# Altium project aig21.PrjPcb
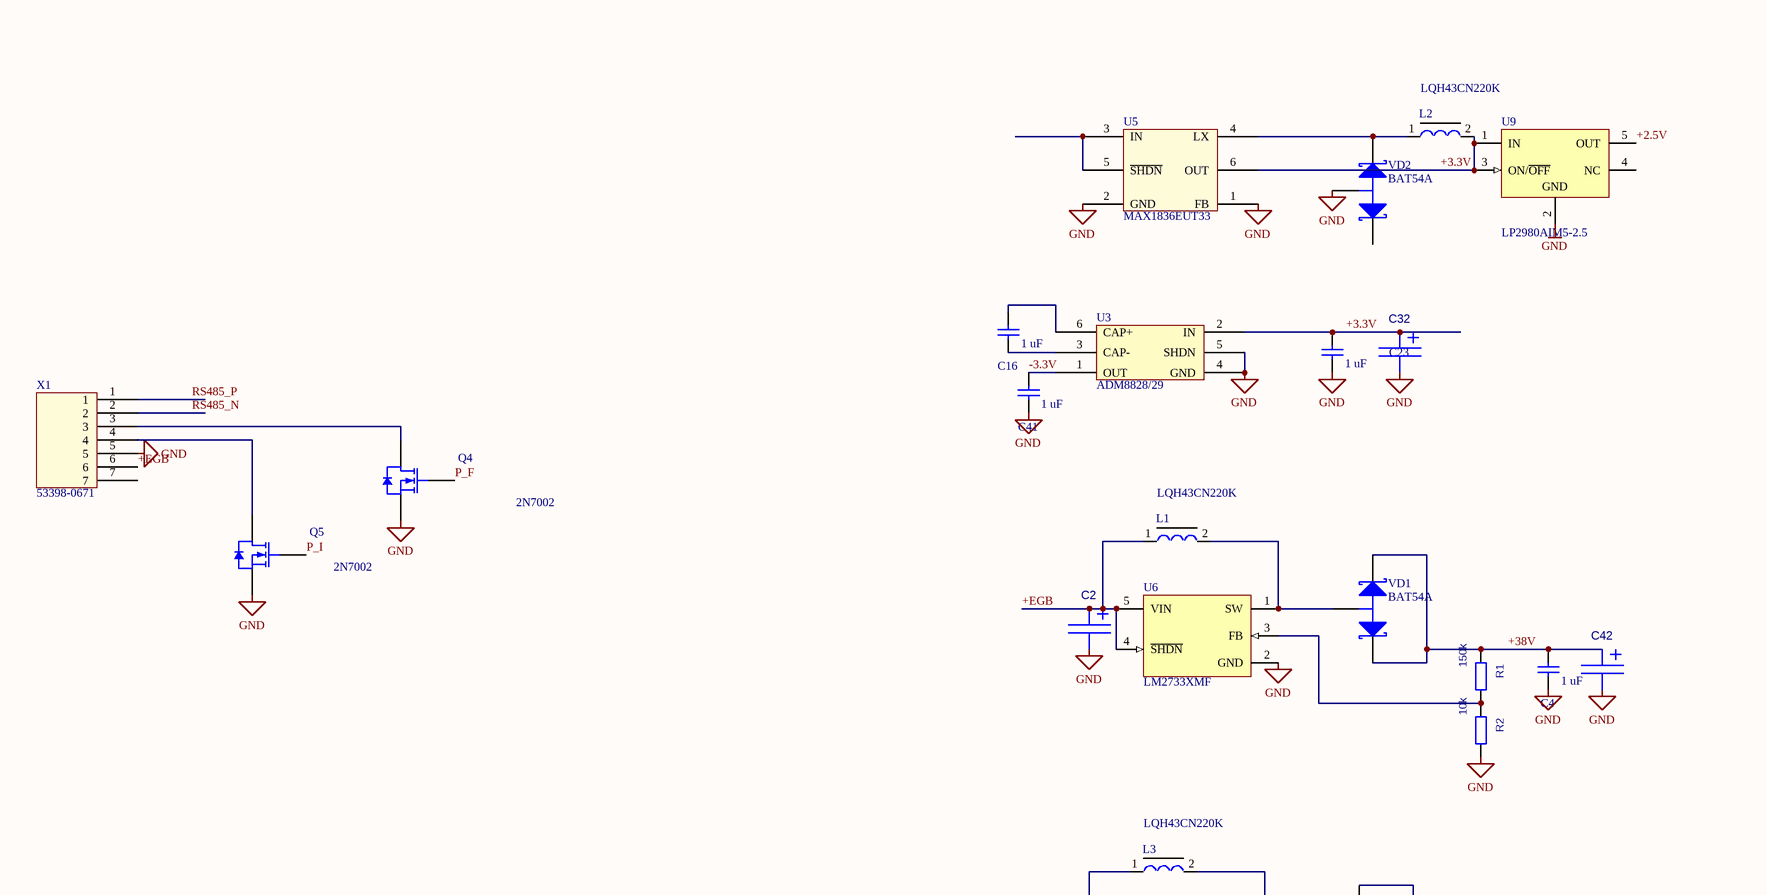
[diagram p0: aig21.SchDoc, top left]
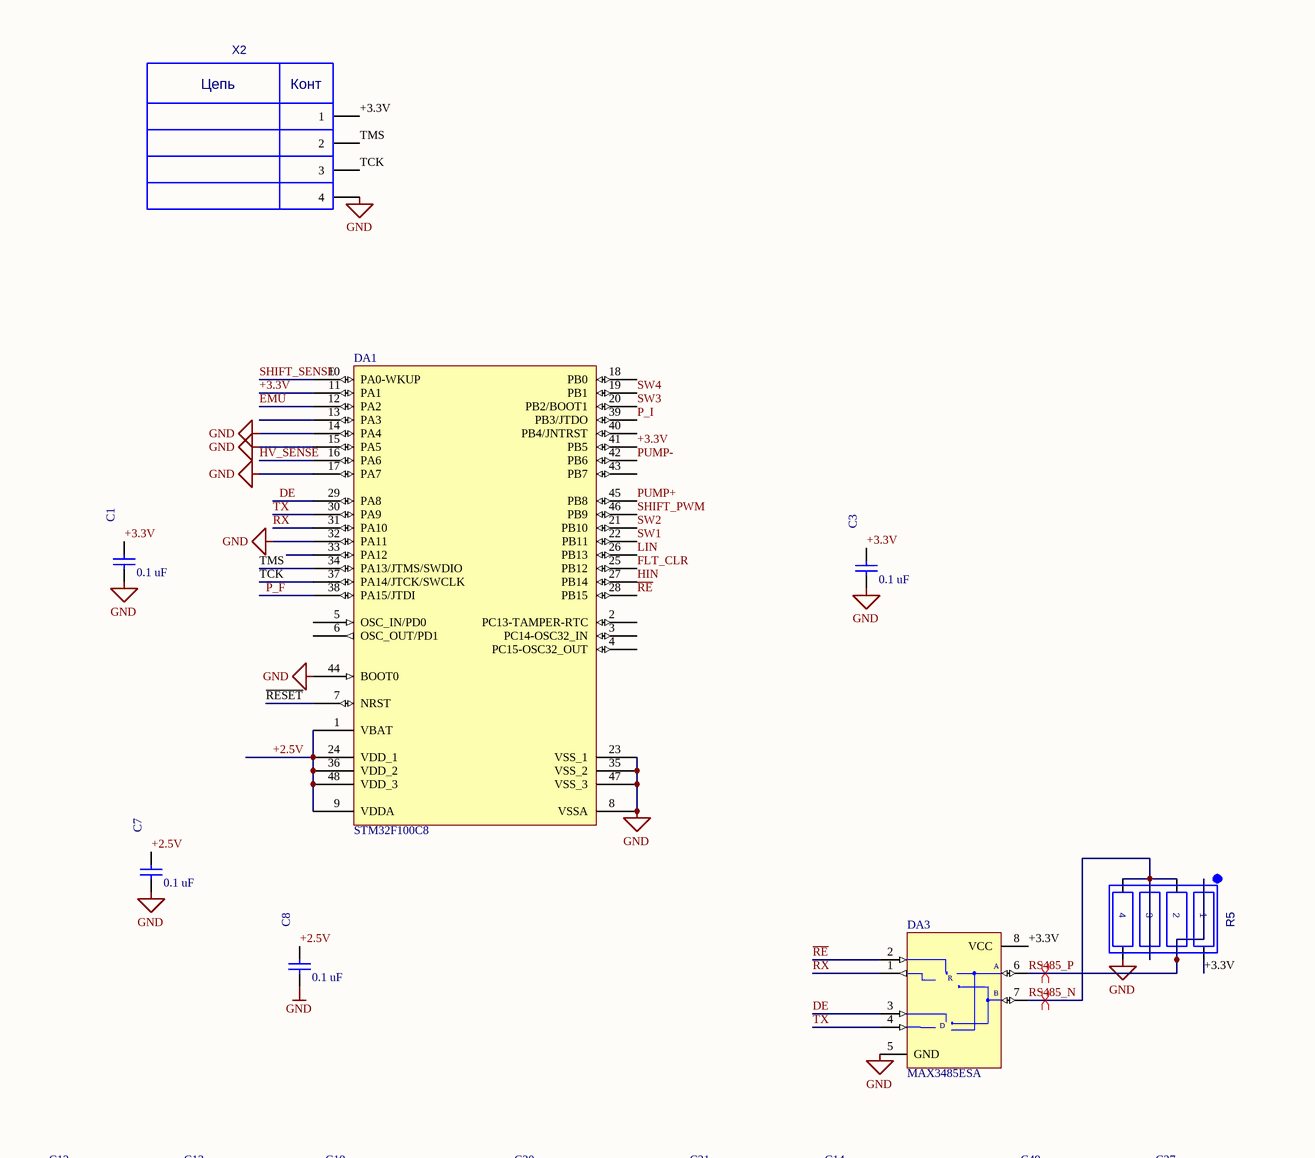
[diagram p1: aig21.SchDoc, top middle]
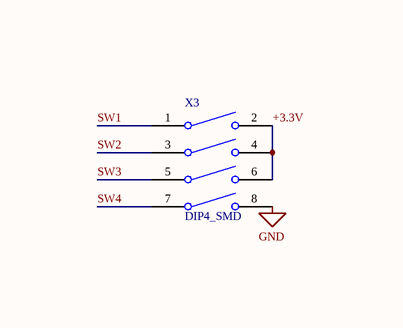
[diagram p2: aig21.SchDoc, top right]
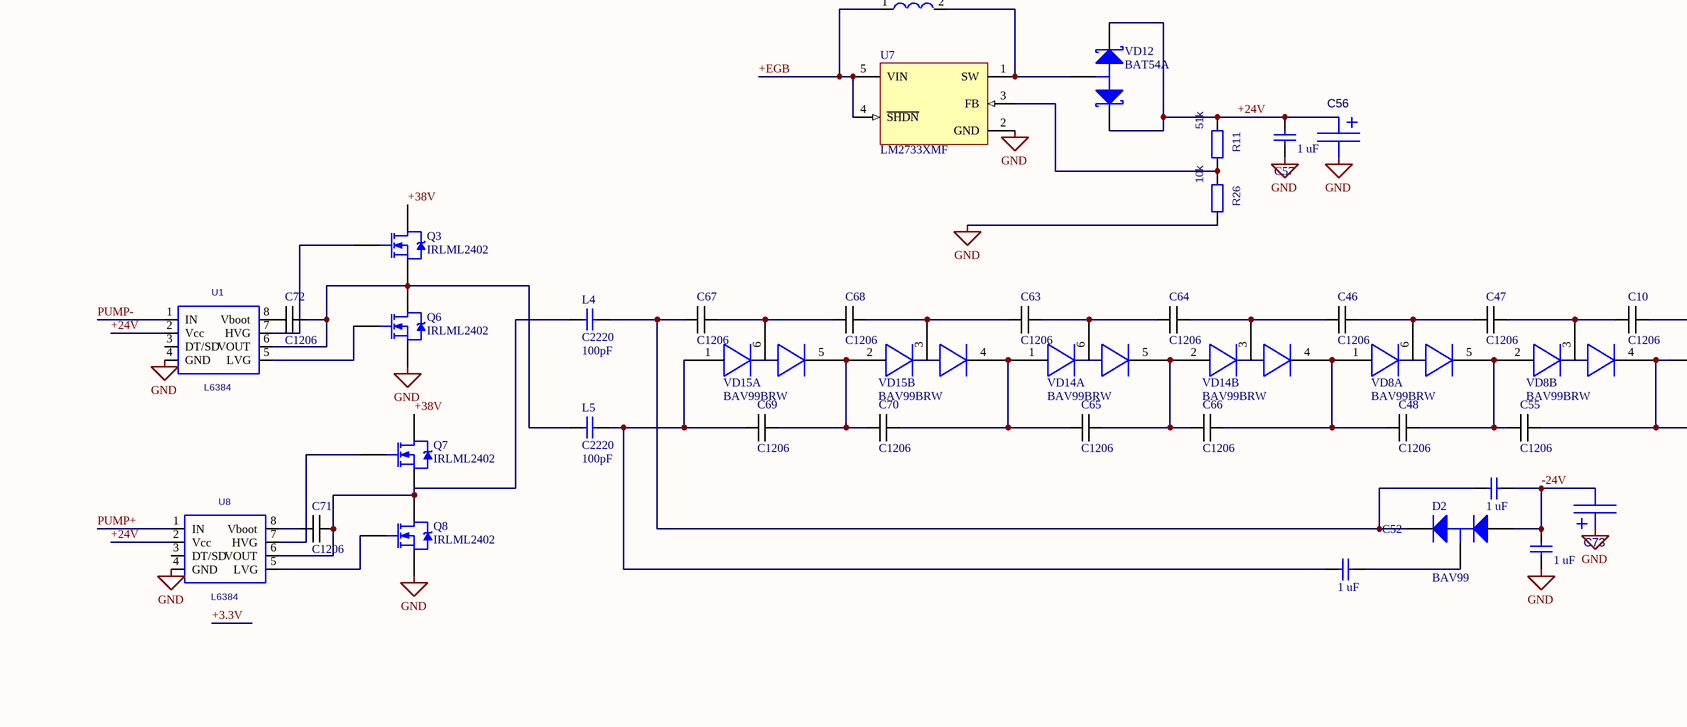
[diagram p3: aig21.SchDoc, bottom left]
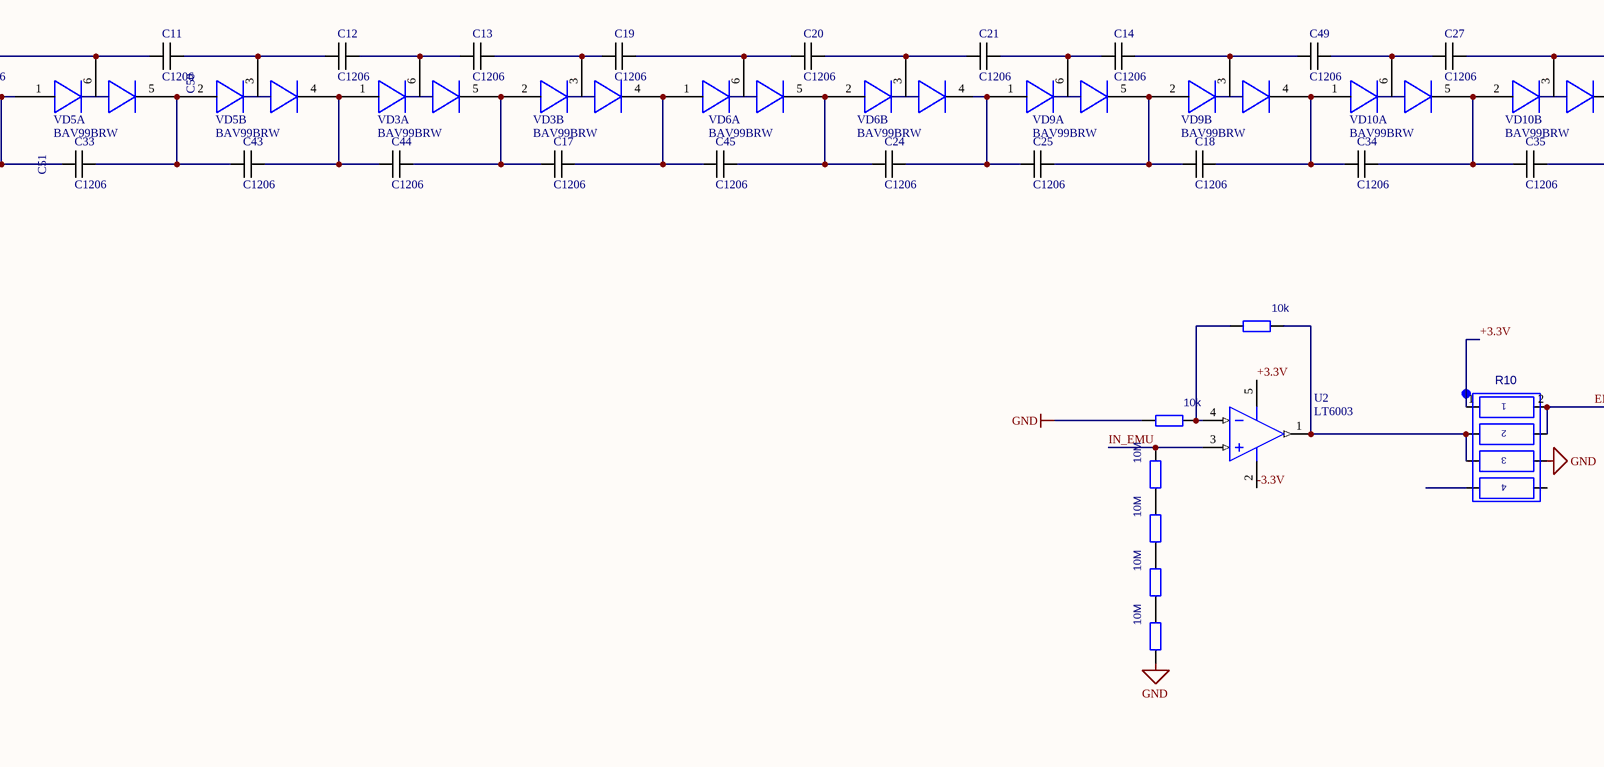
[diagram p4: aig21.SchDoc, bottom middle]
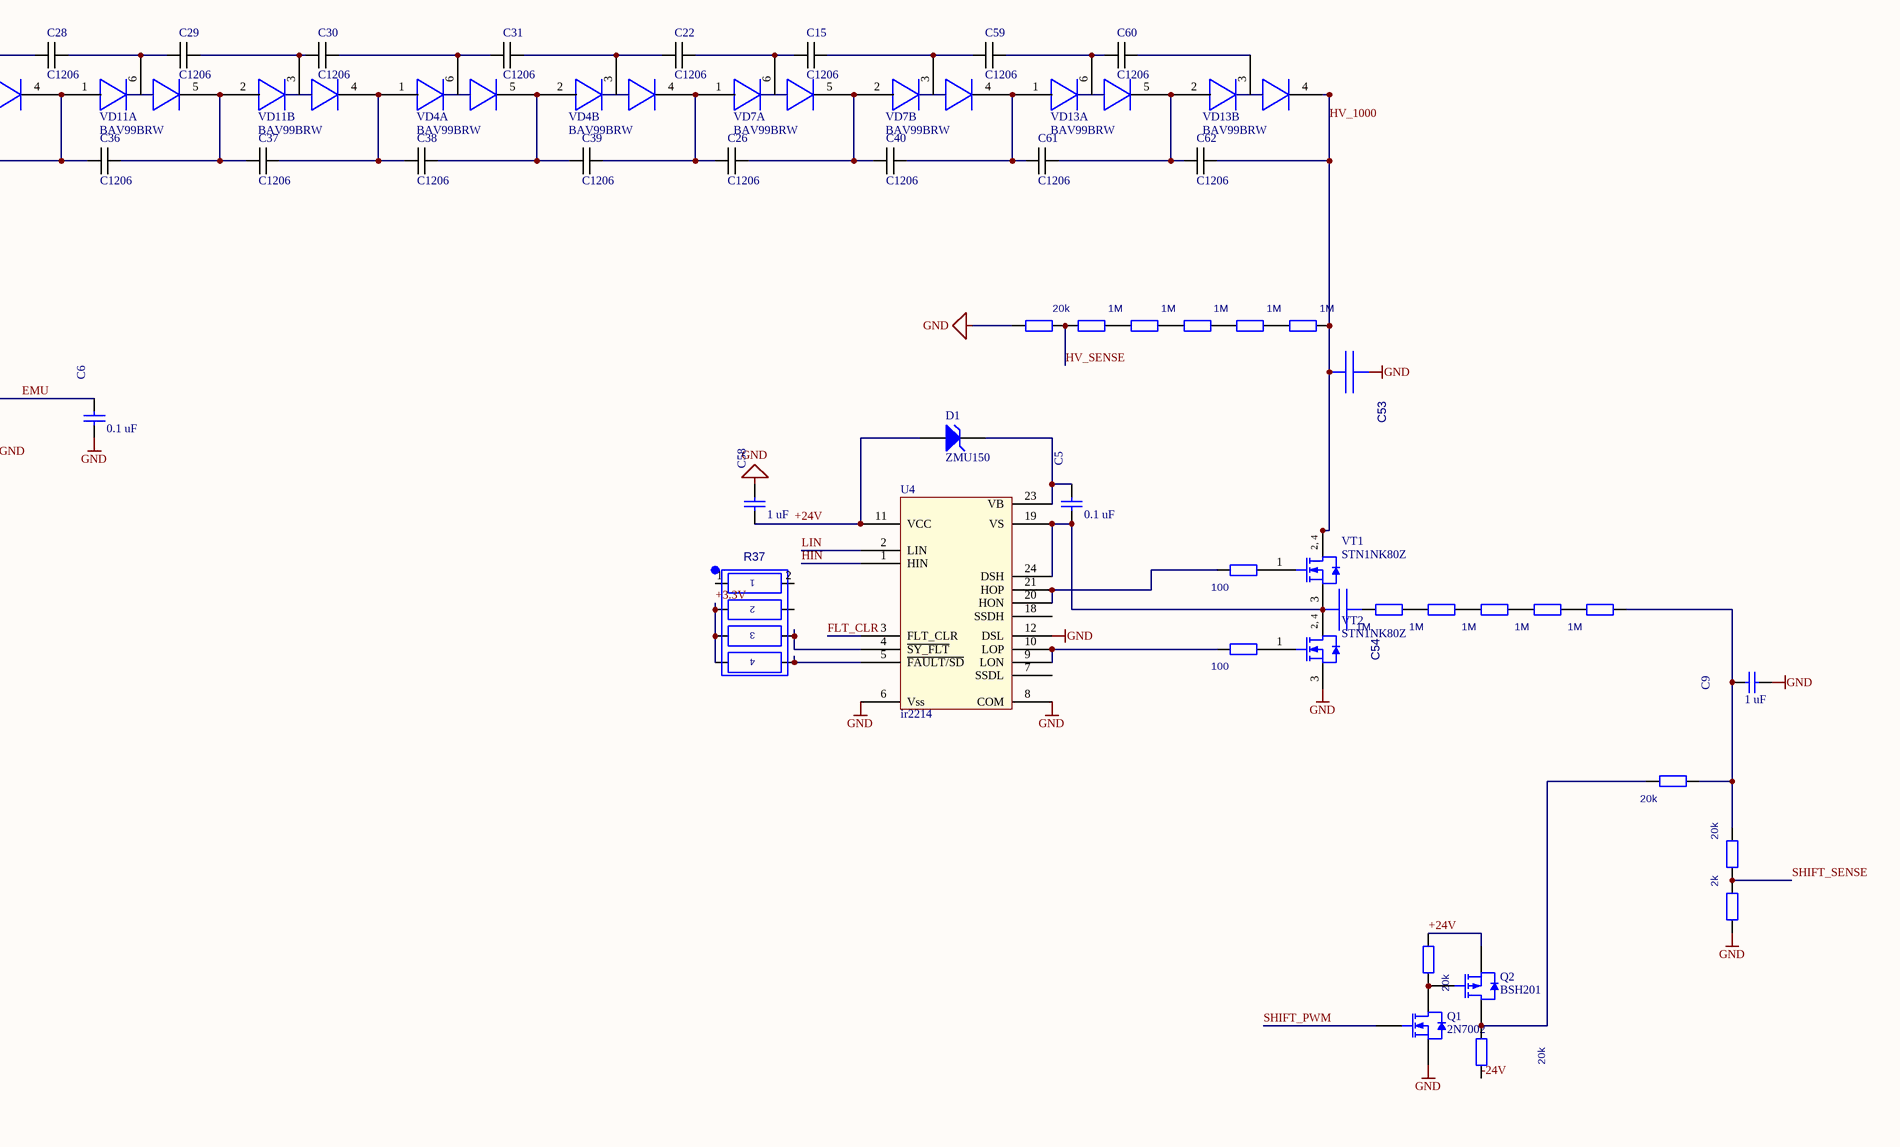
[diagram p5: aig21.SchDoc, bottom right]
1 sheet, 150 parts. Net scope: global (net labels, ports and power ports of the same name join across sheets).
Board file: aig21.PcbDoc

## Sheet aig21.SchDoc
size A0

### Parts
(Parts that share a designator on the sheet are numbered #1, #2 ... from top to bottom, then left to right.)
C1  value 0.1 uF  [CC0805]  (hidden comment: C0805)
C2  CAPASITOR A  [CAPASITOR A]  (value not drawn)
C3  value 0.1 uF  [CC0805]  (hidden comment: C0805)
C4  value 1 uF  [CC0805]  (hidden comment: C0805)
C5  value 0.1 uF  [CC0805]  (hidden comment: C0805)
C6  value 0.1 uF  [CC0805]  (hidden comment: C0805)
C7  value 0.1 uF  [CC0805]  (hidden comment: C0805)
C8  value 0.1 uF  [CC0805]  (hidden comment: C0805)
C9  value 1 uF  [CC0805]  (hidden comment: C0805)
C10  C1206  [С1206]
C11  C1206  [С1206]
C12  C1206  [С1206]
C13  C1206  [С1206]
C14  C1206  [С1206]
C15  C1206  [С1206]
C16  value 1 uF  [CC0805]  (hidden comment: C0805)
C17  C1206  [С1206]
C18  C1206  [С1206]
C19  C1206  [С1206]
C20  C1206  [С1206]
C21  C1206  [С1206]
C22  C1206  [С1206]
C23  value 1 uF  [CC0805]  (hidden comment: C0805)
C24  C1206  [С1206]
C25  C1206  [С1206]
C26  C1206  [С1206]
C27  C1206  [С1206]
C28  C1206  [С1206]
C29  C1206  [С1206]
C30  C1206  [С1206]
C31  C1206  [С1206]
C32  CAPASITOR A  [CAPASITOR A]  (value not drawn)
C33  C1206  [С1206]
C34  C1206  [С1206]
C35  C1206  [С1206]
C36  C1206  [С1206]
C37  C1206  [С1206]
C38  C1206  [С1206]
C39  C1206  [С1206]
C40  C1206  [С1206]
C41  value 1 uF  [CC0805]  (hidden comment: C0805)
C42  CAPASITOR C  [CAPASITOR C]  (value not drawn)
C43  C1206  [С1206]
C44  C1206  [С1206]
C45  C1206  [С1206]
C46  C1206  [С1206]
C47  C1206  [С1206]
C48  C1206  [С1206]
C49  C1206  [С1206]
C50  value 1 uF  [CC0805]  (hidden comment: C0805)
C51  value 1 uF  [CC0805]  (hidden comment: C0805)
C52  value 1 uF  [CC0805]  (hidden comment: C0805)
C53  CC1812  [CC1812]  (value not drawn)
C54  CC1812  [CC1812]  (value not drawn)
C55  C1206  [С1206]
C56  CAPASITOR C  [CAPASITOR C]  (value not drawn)
C57  value 1 uF  [CC0805]  (hidden comment: C0805)
C58  value 1 uF  [CC0805]  (hidden comment: C0805)
C59  C1206  [С1206]
C60  C1206  [С1206]
C61  C1206  [С1206]
C62  C1206  [С1206]
C63  C1206  [С1206]
C64  C1206  [С1206]
C65  C1206  [С1206]
C66  C1206  [С1206]
C67  C1206  [С1206]
C68  C1206  [С1206]
C69  C1206  [С1206]
C70  C1206  [С1206]
C71  C1206  [С1206]
C72  C1206  [С1206]
C73  CAPASITOR C  [CAPASITOR C]  (value not drawn)
D1  ZMU150  [MELF]
D2  BAV99  [SOT-23]
DA1  STM32F100C8  [LQFP48_N]
DA3  MAX3485ESA  [NSO8_N]
L1  LQH43CN220K  [1812]
L2  LQH43CN220K  [1812]
L3  LQH43CN220K  [1812]
L4  C2220  value 100pF  [2220]
L5  C2220  value 100pF  [2220]
Q1  2N7002  [SOT-23]
Q2  BSH201  [SOT23]
Q3  IRLML2402  [SOT-23]
Q4  2N7002  [SOT23_N]
Q5  2N7002  [SOT23_N]
Q6  IRLML2402  [SOT-23]
Q7  IRLML2402  [SOT-23]
Q8  IRLML2402  [SOT-23]
R1  value 150k  [RR0805]
R2  value 10k  [RR0805]
R3  value 10M  [RR0805]
R4  value 10k  [RR0805]
R5  CAY16-J4  [CAY16-F4]  (value not drawn)
R6  value 10M  [RR0805]
R7  value 10M  [RR0805]
R8  value 20k  [RR0805]
R9  value 10k  [RR0805]
R10  CAY16-J4  [CAY16-F4]  (value not drawn)
R11  value 51k  [RR0805]
R12  value 1M  [RR0805]
R13  value 1M  [RR0805]
R14  value 1M  [RR0805]
R15  value 1M  [RR0805]
R16  value 1M  [RR0805]
R17  value 100  [RR0805]
R18  value 100  [RR0805]
R19  value 20k  [RR0805]
R20  value 20k  [RR0805]
R21  value 1M  [RR0805]
R22  value 1M  [RR0805]
R23  value 1M  [RR0805]
R24  value 1M  [RR0805]
R25  value 1M  [RR0805]
R26  value 10k  [RR0805]
R28  value 10M  [RR0805]
R30  value 20k  [RR0805]
R31#1  value 20k  [RR0805]
R31#2  value 2k  [RR0805]
R37  CAY16-J4  [CAY16-F4]  (value not drawn)
U1  L6384  [SO8]
U2  LT6003  [SOT23-5_N]
U3  ADM8828/29  [SOT23-6]
U4  ir2214  [ssop24]
U5  MAX1836EUT33  [SOT23-6]
U6  LM2733XMF  [MF05A_N]
U7  LM2733XMF  [MF05A_N]
U8  L6384  [SO8]
U9  LP2980AIM5-2.5  [MF05A_N]
VD1  BAT54A  [SOT23_N]
VD2  BAT54A  [SOT-23]
VD3  BAV99BRW  [SOT-363]  (parts A,B of 2)
VD4  BAV99BRW  [SOT-363]  (parts A,B of 2)
VD5  BAV99BRW  [SOT-363]  (parts A,B of 2)
VD6  BAV99BRW  [SOT-363]  (parts A,B of 2)
VD7  BAV99BRW  [SOT-363]  (parts A,B of 2)
VD8  BAV99BRW  [SOT-363]  (parts A,B of 2)
VD9  BAV99BRW  [SOT-363]  (parts A,B of 2)
VD10  BAV99BRW  [SOT-363]  (parts A,B of 2)
VD11  BAV99BRW  [SOT-363]  (parts A,B of 2)
VD12  BAT54A  [SOT23_N]
VD13  BAV99BRW  [SOT-363]  (parts A,B of 2)
VD14  BAV99BRW  [SOT-363]  (parts A,B of 2)
VD15  BAV99BRW  [SOT-363]  (parts A,B of 2)
VT1  STN1NK80Z  [SOT223_N]
VT2  STN1NK80Z  [SOT223_N]
X1  53398-0671  [53398-0671]
X2  53398-0471  [53398-0471]  (value not drawn)
X3  DIP4_SMD  [DIP4_SOP]

### Nets
GND: C1.1 C2.2(i/o1) C3.1 C4.2 C6.1 C7.1 C8.1 C9.1 C23.2 C32.2(i/o1) C41.2 C42.2(i/o1) C52.1 C53.1(i/o) C56.2(i/o1) C57.2 C58.2 C73.1(i/o) DA1.8(VSSA) DA1.14(PA4) DA1.15(PA5) DA1.17(PA7) DA1.23(VSS_1) DA1.32(PA11) DA1.35(VSS_2) DA1.44(BOOT0) DA1.47(VSS_3) DA3.5(GND) Q1.2(S) Q4.2(S) Q5.2(S) Q6.2(S) Q8.2(S) R2.2 R4.2 R5.8(I/O1) R8.2 R10.6(I/O1) R26.2 R28.2 R31#2.2 U1.4(GND) U3.4(GND) U3.5(SHDN) U4.6(Vss) U4.8(COM) U4.12(DSL) U5.1(FB) U5.2(GND) U6.2(GND) U7.2(GND) U8.4(GND) U9.2(GND) VD2.3(A) VT2.3(S) X1.5 X2.4 X3.8
+2.5V: C7.2 C8.2 DA1.1(VBAT) DA1.9(VDDA) DA1.24(VDD_1) DA1.36(VDD_2) DA1.48(VDD_3) U9.5(OUT)
+3.3V: C1.2 C3.2 C23.1 C32.1(i/o) DA1.11(PA1) DA1.41(PB5) DA3.8(VCC) L2.2 R5.2(I/O1) R10.1(I/O0) R37.3(I/O0) R37.5(I/O0) R37.7(I/O0) U2.5(VCC) U3.2(IN) U5.6(OUT) U9.1(IN) U9.3(ON/~{OFF}) X2.1 X3.2 X3.4 X3.6
+24V: C56.1(i/o) C57.1 C58.1 D1.1(A) Q2.2(S) R11.1 R20.2 U1.2(Vcc) U4.11(VCC) U8.2(Vcc) VD12.1(K1) VD12.2(K2)
+38V: C4.1 C42.1(i/o) Q3.3(D) Q7.3(D) R1.1 VD1.1(K1) VD1.2(K2)
+EGB: C2.1(i/o) L1.1 L3.1 U6.4(~{SHDN}) U6.5(VIN) U7.4(~{SHDN}) U7.5(VIN) X1.6
-3.3V: C41.1 U2.2(VEE) U3.1(OUT)
-24V: C50.2 C52.2 C73.2(i/o1) D2.1(A) R19.1
DE: DA1.29(PA8) DA3.3(DE)
EMU: C6.2 DA1.12(PA2) R10.2(I/O1) R10.4(I/O1)
FLT_CLR: DA1.25(PB12) U4.3(FLT_CLR)
HIN: DA1.27(PB14) U4.1(HIN)
HV_1000: C53.2(i/o1) C62.1 R16.1 VD13.4(K2) VT1.2(D) VT1.4(D)
HV_SENSE: DA1.16(PA6) R8.1 R12.2
IN_EMU: R3.1 U2.3(IN+)
LIN: DA1.26(PB13) U4.2(LIN)
P_F: DA1.38(PA15/JTDI) Q4.1(G)
P_I: DA1.39(PB3/JTDO) Q5.1(G)
PUMP+: DA1.45(PB8) U8.1(IN)
PUMP-: DA1.42(PB6) U1.1(IN)
~{RE}: DA1.28(PB15) DA3.2(~{RE})
~{RESET}: DA1.7(NRST)
RS485_N: DA3.7(B) R5.3(I/O0) R5.5(I/O0) R5.6(I/O1) R5.7(I/O0) X1.2
RS485_P: DA3.6(A) R5.1(I/O0) R5.4(I/O1) X1.1
RX: DA1.31(PA10) DA3.1(RO)
SHIFT_PWM: DA1.46(PB9) Q1.1(G)
SHIFT_SENSE: DA1.10(PA0-WKUP) R30.2 R31#2.1
SW1: DA1.22(PB11) X3.1
SW2: DA1.21(PB10) X3.3
SW3: DA1.20(PB2/BOOT1) X3.5
SW4: DA1.19(PB1) X3.7
TCK: DA1.37(PA14/JTCK/SWCLK) X2.3
TMS: DA1.34(PA13/JTMS/SWDIO) X2.2
TX: DA1.30(PA9) DA3.4(DI)
NetC5_1: C5.1 C54.2(i/o1) U4.19(VS) U4.24(DSH) VT1.3(S) VT2.2(D) VT2.4(D)
NetC5_2: C5.2 D1.2(K) U4.23(VB)
NetC9_2: C9.2 R25.2 R30.1 R31#1.2
NetC10_1: C10.1 C11.2 VD5.6(C1)
NetC10_2: C10.2 C47.1 VD8.3(C2)
NetC11_1: C11.1 C12.2 VD5.3(C2)
NetC12_1: C12.1 C13.2 VD3.6(C1)
NetC13_1: C13.1 C19.2 VD3.3(C2)
NetC14_1: C14.1 C49.2 VD9.3(C2)
NetC14_2: C14.2 C21.1 VD9.6(C1)
NetC15_1: C15.1 C59.2 VD7.3(C2)
NetC15_2: C15.2 C22.1 VD7.6(C1)
NetC16_1: C16.1 U3.6(CAP+)
NetC16_2: C16.2 U3.3(CAP-)
NetC17_1: C17.1 C45.2 VD3.4(K2) VD6.1(A1)
NetC17_2: C17.2 C44.1 VD3.2(A2) VD3.5(K1)
NetC18_1: C18.1 C34.2 VD9.4(K2) VD10.1(A1)
NetC18_2: C18.2 C25.1 VD9.2(A2) VD9.5(K1)
NetC19_1: C19.1 C20.2 VD6.6(C1)
NetC20_1: C20.1 C21.2 VD6.3(C2)
NetC22_2: C22.2 C31.1 VD4.3(C2)
NetC24_1: C24.1 C25.2 VD6.4(K2) VD9.1(A1)
NetC24_2: C24.2 C45.1 VD6.2(A2) VD6.5(K1)
NetC26_1: C26.1 C40.2 VD7.2(A2) VD7.5(K1)
NetC26_2: C26.2 C39.1 VD4.4(K2) VD7.1(A1)
NetC27_1: C27.1 C28.2 VD10.3(C2)
NetC27_2: C27.2 C49.1 VD10.6(C1)
NetC28_1: C28.1 C29.2 VD11.6(C1)
NetC29_1: C29.1 C30.2 VD11.3(C2)
NetC30_1: C30.1 C31.2 VD4.6(C1)
NetC33_1: C33.1 C43.2 VD5.2(A2) VD5.5(K1)
NetC33_2: C33.2 C55.1 VD5.1(A1) VD8.4(K2)
NetC34_1: C34.1 C35.2 VD10.2(A2) VD10.5(K1)
NetC35_1: C35.1 C36.2 VD10.4(K2) VD11.1(A1)
NetC36_1: C36.1 C37.2 VD11.2(A2) VD11.5(K1)
NetC37_1: C37.1 C38.2 VD4.1(A1) VD11.4(K2)
NetC38_1: C38.1 C39.2 VD4.2(A2) VD4.5(K1)
NetC40_1: C40.1 C61.2 VD7.4(K2) VD13.1(A1)
NetC43_1: C43.1 C44.2 VD3.1(A1) VD5.4(K2)
NetC46_1: C46.1 C47.2 VD8.6(C1)
NetC46_2: C46.2 C64.1 VD14.3(C2)
NetC48_1: C48.1 C55.2 VD8.2(A2) VD8.5(K1)
NetC48_2: C48.2 C66.1 VD8.1(A1) VD14.4(K2)
NetC50_1: C50.1 C67.2 D2.2(K) L4.2
NetC51_1: C51.1 C69.2 L5.2 VD15.1(A1)
NetC51_2: C51.2 D2.3(C)
NetC54_1: C54.1(i/o) R21.1
NetC59_1: C59.1 C60.2 VD13.6(C1)
NetC60_1: C60.1 VD13.3(C2)
NetC61_1: C61.1 C62.2 VD13.2(A2) VD13.5(K1)
NetC63_1: C63.1 C64.2 VD14.6(C1)
NetC63_2: C63.2 C68.1 VD15.3(C2)
NetC65_1: C65.1 C66.2 VD14.2(A2) VD14.5(K1)
NetC65_2: C65.2 C70.1 VD14.1(A1) VD15.4(K2)
NetC67_1: C67.1 C68.2 VD15.6(C1)
NetC69_1: C69.1 C70.2 VD15.2(A2) VD15.5(K1)
NetC71_1: C71.1 U8.8(Vboot)
NetC71_2: C71.2 L4.1 Q7.2(S) Q8.3(D) U8.6(VOUT)
NetC72_1: C72.1 L5.1 Q3.2(S) Q6.3(D) U1.6(VOUT)
NetC72_2: C72.2 U1.8(Vboot)
NetL1_2: L1.2 U6.1(SW) VD1.3(A)
NetL2_1: L2.1 U5.4(LX) VD2.2(K2)
NetL3_2: L3.2 U7.1(SW) VD12.3(A)
NetQ1_3: Q1.3(D) Q2.1(G) R20.1
NetQ2_3: Q2.3(D) R19.2 R31#1.1
NetQ3_1: Q3.1(G) U1.7(HVG)
NetQ4_3: Q4.3(D) X1.3
NetQ5_3: Q5.3(D) X1.4
NetQ6_1: Q6.1(G) U1.5(LVG)
NetQ7_1: Q7.1(G) U8.7(HVG)
NetQ8_1: Q8.1(G) U8.5(LVG)
NetR1_2: R1.2 R2.1 U6.3(FB)
NetR3_2: R3.2 R6.1
NetR4_1: R4.1 R9.2 U2.4(IN-)
NetR6_2: R6.2 R7.1
NetR7_2: R7.2 R28.1
NetR9_1: R9.1 R10.3(I/O0) R10.5(I/O0) U2.1(OUT)
NetR11_2: R11.2 R26.1 U7.3(FB)
NetR12_1: R12.1 R13.2
NetR13_1: R13.1 R14.2
NetR14_1: R14.1 R15.2
NetR15_1: R15.1 R16.2
NetR17_1: R17.1 U4.20(HON) U4.21(HOP)
NetR17_2: R17.2 VT1.1(G)
NetR18_1: R18.1 U4.9(LON) U4.10(LOP)
NetR18_2: R18.2 VT2.1(G)
NetR21_2: R21.2 R22.1
NetR22_2: R22.2 R23.1
NetR23_2: R23.2 R24.1
NetR24_2: R24.2 R25.1
NetR37_6: R37.6(I/O1) U4.4(~{SY_FLT})
NetR37_8: R37.8(I/O1) U4.5(~{FAULT/SD})
NetU5_3: U5.3(IN) U5.5(~{SHDN})

Not connected (* = marked no-connect by the designer): DA1 2(PC13-TAMPER-RTC) 3(PC14-OSC32_IN) 4(PC15-OSC32_OUT) 5(OSC_IN/PD0) 6(OSC_OUT/PD1) 13(PA3) 18(PB0) 33(PA12) 40(PB4/JNTRST) 43(PB7); R10 7(I/O0) 8(I/O1); R37 1(I/O0) 2(I/O1) 4(I/O1); U1 3(DT/SD); U4 7(SSDL) 18(SSDH); U8 3(DT/SD); U9 4(NC); VD2 1(K1); X1 7; X2 5(mh1) 6(mh2)

### Layout directives
differential pair: RS485_N, RS485_P

### Notes on the sheet
- (in symbol 53398-0471) Цепь; Конт
- (in symbol BSP130) 2, 4
- (in symbol MAX485ESA) R; D

### Library data of the parts
C1 C3-C9 C16 C23 C41 C50-C52 C57 C58 = C0805: Ceramic Chip Capacitor - Standard; Note: Footprint corresponds to dimensions for bulk cassette packaging. This case size has tightened tolerances.; Published: 17-Jul-2002; LatestRevisionDate: 19-Mar-2004; LatestRevisionNote: Silkscreen size reduced.; DatasheetDocument: Mar-2001; PackageDocument: Mar-2001; PackageReference: 0805; Publisher: Altium Limited; Code_JEITA: 0805; Code_IPC: 2012[0805]; ComponentLink1Description: Manufacturer Link; ComponentLink1URL: http://www.kemet.com/; ComponentLink2Description: Datasheet; ComponentLink2URL: http://www.kemet.com/kemet/web/homepage/kechome.nsf/vapubfilesname/F3102TA.pdf/$file/F3102TA.pdf
C10-C15 C17-C22 C24-C31 C33-C40 C43-C49 C55 C59-C72 = С1206: Конденсатор
C32 = CAPASITOR A: Value: 68uF X 6.3V
C42 = CAPASITOR C: Value: 50V
C53 C54 = CC1812: Value: 2200 x 3kV
C56 C73 = CAPASITOR C: Value: 25V
D1 = ZMU150: High-Voltage Power Zener Diode; Published: 8-Jun-2000; LatestRevisionDate: 19-Mar-2004; LatestRevisionNote: Silkscreen size reduced.; DatasheetDocument: 16-May-1997; PackageDocument: May-1997; PackageReference: MELF; Publisher: Altium Limited; ComponentLink1Description: Manufacturer Link; ComponentLink1URL: http://www.vishay.com/
D2 = BAV99: Silicon Switching Diode Array for High-Speed Switching; Published: 21-Mar-2003; DatasheetDocument: Oct-1999; PackageDocument: Sep-2001; PackageReference: SOT-23; Publisher: Altium Limited; ComponentLink1Description: Manufacturer Link; ComponentLink1URL: http://www.infineon.com/; ComponentLink2Description: Datasheet; ComponentLink2URL: http://www.infineon.com/upload/Document/cmc_upload/documents/080/631/bav99series_1.pdf
DA1 = STM32F101C6T6: STM32 ARM-based 32-bit MCU with 32 Kbytes Flash, 48-pin LQFP, Industrial Temperature; Published: 30-May-2008; DatasheetVersion: rev6, Mar-2008; PackageVersion: Mar-2008; PackageReference: LQFP48; Publisher: Altium Limited; PackageDescription: 48-Pin Low-Profile Quad Flat Pack, 7 x 7 mm Body, 0.5 mm Pitch (LQFP48); ComponentLink1Description: Manufacturer Link; ComponentLink1URL: www.st.com/stm32; ComponentLink2Description: Datasheet; ComponentLink2URL: http://www.st.com/stonline/products/literature/ds/13586.pdf
DA3 = MAX485ESA: Low-Power, Slew-Rate-Limited RS-485/RS-422 Transceiver; Published: 16-Jan-2001; LatestRevisionDate: 13-Apr-2006; LatestRevisionNote: IPC-7351 Footprint Added.; DatasheetVersion: Feb-1996; PackageReference: NSO8; Publisher: Altium Limited; PackageDescription: 8-Pin Small Outline Integrated Circuit 1.27 mm Pitch; Code_JEDEC: MS-012-AA; Code_IPC: SOIC127P600-8; ComponentLink1Description: Manufacturer Link; ComponentLink1URL: http://www.maxim-ic.com/; ComponentLink2Description: Datasheet; ComponentLink2URL: http://pdfserv.maxim-ic.com/en/ds/MAX1487-MAX491.pdf
L1-L3 = CDRH127: Дроссель
L4 L5 = C2220: Ceramic Chip Capacitor - Standard; Published: 17-Jul-2002; LatestRevisionDate: 19-Mar-2004; LatestRevisionNote: Silkscreen size reduced.; DatasheetDocument: Mar-2001; PackageDocument: Mar-2001; PackageReference: 2220; Publisher: Altium Limited; Code_JEITA: 2220; ComponentLink1Description: Manufacturer Link; ComponentLink1URL: http://www.kemet.com/; ComponentLink2Description: Datasheet; ComponentLink2URL: http://www.kemet.com/kemet/web/homepage/kechome.nsf/vapubfilesname/F3102TA.pdf/$file/F3102TA.pdf
Q1 Q4 Q5 = 2N7002: N-channel Enhancement Mode Field-effect Transistor; Published: 17-Sep-2003; LatestRevisionDate: 12-Dec-2006; LatestRevisionNote: IPC-7351 Footprint Added.; DatasheetVersion: 27-Jul-2000; PackageVersion: May-1999; PackageReference: SOT23; Publisher: Altium Limited; PackageDescription: 3-Pin SOT-23 Package 0.95 mm Pitch, 2.3 mm Lead Span; ComponentLink1Description: Manufacturer Link; ComponentLink1URL: http://www.semiconductors.philips.com/; ComponentLink2Description: Datasheet; ComponentLink2URL: http://www.semiconductors.philips.com/acrobat/datasheets/2N7002_4.pdf
Q2 = BSH201: P-channel Enhancement Mode MOSFET; Published: 17-Sep-2003; LatestRevisionDate: 12-Dec-2006; LatestRevisionNote: IPC-7351 Footprint Added.; DatasheetVersion: Aug-1998; PackageVersion: May-1999; PackageReference: SOT23; Publisher: Altium Limited; PackageDescription: 3-Pin SOT-23 Package 0.95 mm Pitch, 2.3 mm Lead Span; ComponentLink1Description: Manufacturer Link; ComponentLink1URL: http://www.semiconductors.philips.com/; ComponentLink2Description: Datasheet; ComponentLink2URL: http://www.semiconductors.philips.com/acrobat/datasheets/BSH201_3.pdf
Q3 Q6-Q8 = IRLML2402: HEXFET Power MOSFET; Published: 8-Jun-2000; LatestRevisionDate: 17-Jul-2002; LatestRevisionNote: Re-released for DXP Platform.; DatasheetVersion: Aug-1997; PackageReference: SOT-23; Publisher: Altium Limited; PackageDescription: SOT-23; 3 Leads; Body 3.1 x 2.5 mm, inc. leads (LxW max); ComponentLink1Description: Manufacturer Link; ComponentLink1URL: http://www.irf.com/; ComponentLink2Description: Datasheet; ComponentLink2URL: http://www.irf.com/product-info/datasheets/data/irlml2402.pdf
R1-R4 R6-R9 R11-R26 R28 R30 R31#1 R31#2 = R_0805: Price: {Price}
R5 = CAY16-J4: Value: 100
R10 R37 = CAY16-J4: Value: 10k
U2 = MAX4104EUK-T: 740MHz, Low-Noise, Low-Distortion Op Amp in SOT23-5; Published: 23-Sep-2002; LatestRevisionDate: 29-May-2009; LatestRevisionNote: IPC-7351 Footprint Added.; DatasheetVersion: Rev 3; 10/98; PackageVersion: revE, 2004; PackageReference: SOT23-5; Publisher: Altium Limited; PackageDescription: 5-Pin SOT-23 Package 0.95 mm Pitch, 2.8 mm Lead Span; Code_JEITA: SC-74A; Code_IPC: SOT23-5; ComponentLink1Description: Manufacturer Link; ComponentLink1URL: http://www.maxim-ic.com/; ComponentLink2Description: Datasheet; ComponentLink2URL: http://pdfserv.maxim-ic.com/en/ds/MAX4104-MAX4305.pdf
U3 = ADM8828/29: Микросхема
U4 = ir2214: Микросхема
U5 = MAX1836: Микросхема
U6 U7 = LM2733XMF: 0.6/1.6 MHz Boost Converters With 40V Internal FET Switch in SOT-23; Manufacturer: National Semiconductor; CompType: Switcher; PackageTopMarking: S52A*XTT; PowerWise: N; FirstPublished: 4-Dec-2008; DatasheetVersion: Jul-2007; PackageVersion: revD, Aug-2008; PackageReference: MF05A; Publisher: Altium Limited; PackageDescription: Molded SOT-23, .115 x .063 x .040 in Body, 5 Lead, .0375 in Pitch; PartNumber: LM2733XMF; RoHS: O; PinCount: 5; DigiKeyPartNumber: LM2733XMFCT-ND; ComponentLink1Description: LM2733 Datasheet; ComponentLink1URL: http://www.national.com/ds/LM/LM2733.pdf; ComponentLink2Description: LM2733 Web Page; ComponentLink2URL: http://www.national.com/pf/LM/LM2733.html; ComponentLink3Description: MF05A Package Page; ComponentLink3URL: http://www.national.com/packaging/folders/mf05a.html
U9 = LP2980AIM5-2.5: Micropower 50 mA Ultra Low-Dropout Regulator In SOT-23 and micro SMD Packages; Manufacturer: National Semiconductor; CompType: LDO IC; PackageTopMarking: L0NA*XTT; PowerWise: N; Published: 4-Dec-2008; DatasheetVersion: Sep-2006; PackageVersion: revD, Aug-2008; PackageReference: MF05A; Publisher: Altium Limited; PackageDescription: Molded SOT-23, .115 x .063 x .040 in Body, 5 Lead, .0375 in Pitch; PartNumber: LP2980AIM5-2.5; RoHS: O; PinCount: 5; DigiKeyPartNumber: LP2980AIM5-2.5CT-ND; ComponentLink1Description: LP2980 Datasheet; ComponentLink1URL: http://www.national.com/ds/LP/LP2980.pdf; ComponentLink2Description: LP2980 Web Page; ComponentLink2URL: http://www.national.com/pf/LP/LP2980.html; ComponentLink3Description: MF05A Package Page; ComponentLink3URL: http://www.national.com/packaging/folders/mf05a.html
VD1 VD2 VD12 = BAT54A: Schottky Barrier Double Diode; Published: 17-Sep-2003; LatestRevisionDate: 12-Dec-2006; LatestRevisionNote: IPC-7351 Footprint Added.; DatasheetVersion: 4-Mar-2002; PackageVersion: May-1999; PackageReference: SOT23; Publisher: Altium Limited; PackageDescription: 3-Pin SOT-23 Package 0.95 mm Pitch, 2.3 mm Lead Span; ComponentLink1Description: Manufacturer Link; ComponentLink1URL: http://www.semiconductors.philips.com/; ComponentLink2Description: Datasheet; ComponentLink2URL: http://www.semiconductors.philips.com/acrobat/datasheets/BAT54_SERIES_4.pdf
VD3-VD11 VD13-VD15 = BAV99BRW: Диод
VT1 VT2 = BSP130: N-channel Enhancement Mode Vertical D-MOSFET; Published: 17-Sep-2003; LatestRevisionDate: 12-Dec-2006; LatestRevisionNote: IPC-7351 Footprint Added.; DatasheetVersion: 11-Dec-2001; PackageVersion: Aug-2001; PackageReference: SOT223; Publisher: Altium Limited; PackageDescription: 4-Pin SOT-223 Package 2.3 mm Pitch, 7 mm Lead Span; ComponentLink1Description: Manufacturer Link; ComponentLink1URL: http://www.semiconductors.philips.com/; ComponentLink2Description: Datasheet; ComponentLink2URL: http://www.semiconductors.philips.com/acrobat/datasheets/BSP130_3.pdf
X1 = 53398-0671: Разъем
X3 = SW_DIP4_SMD: DIP Переключатель
C2 = CAPASITOR A: Value: *
U1 U8 = L6384: Value: *
X2 = 53398-0471: Value: *